# EAGLE design BQ25504 (EAGLE 7.1.0)
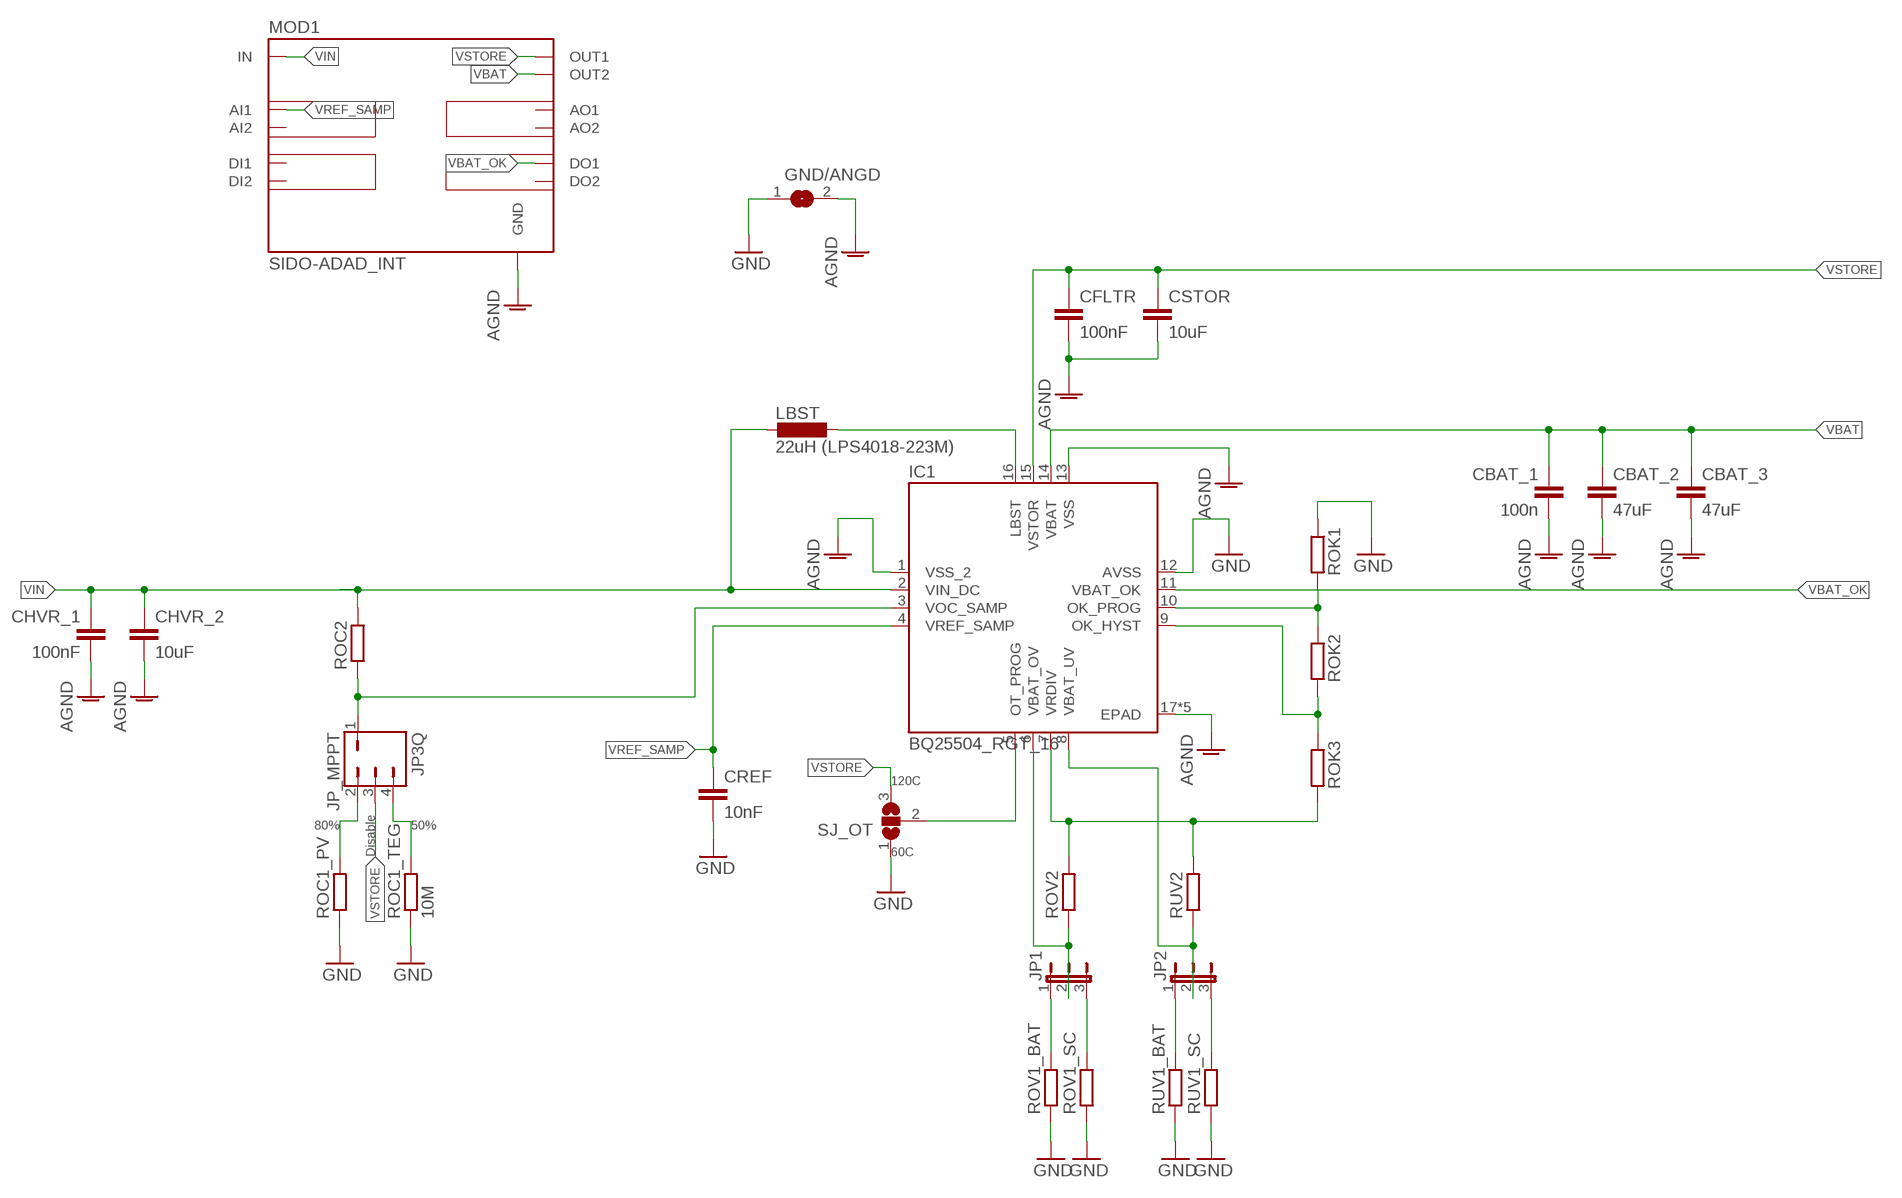
[diagram p0: schematic, sheet 1]

## Parts
CBAT_1  100n  C-EUC0805K  [C0805K]
CBAT_2  47uF  C-EUC0805K  [C0805K]
CBAT_3  47uF  C-EUC0805K  [C0805K]
CFLTR  100nF  C-EUC0805K  [C0805K]
CHVR_1  100nF  C-EUC0805K  [C0805K]
CHVR_2  10uF  C-EUC0805K  [C0805K]
CREF  10nF  C-EUC0805K  [C0805K]
CSTOR  10uF  C-EUC0805K  [C0805K]
GND/ANGD  SJ  [SJ]
IC1  BQ25504_RGT_16  [RGT16_1P7X1P7]
JP1  JP2E  [JP2]
JP2  JP2E  [JP2]
JP_MPPT  JP3Q  [JP1-3]
LBST  22uH (LPS4018-223M)  LPS4018  [LPS4018]
MOD1  SIDO-ADAD_INT  [SIDO-ADAD]
ROC1_PV  R-EU_R0805  [R0805]
ROC1_TEG  10M  R-EU_R0805  [R0805]
ROC2  R-EU_R0805  [R0805]
ROK1  R-EU_R0805  [R0805]
ROK2  R-EU_R0805  [R0805]
ROK3  R-EU_R0805  [R0805]
ROV1_BAT  R-EU_R0805  [R0805]
ROV1_SC  R-EU_R0805  [R0805]
ROV2  R-EU_R0805  [R0805]
RUV1_BAT  R-EU_R0805  [R0805]
RUV1_SC  R-EU_R0805  [R0805]
RUV2  R-EU_R0805  [R0805]
SJ_OT  SJ3  [SJ3]

## Nets
AGND: CBAT_1.2 CBAT_2.2 CBAT_3.2 CFLTR.2 CHVR_1.2 CHVR_2.2 CSTOR.2 GND/ANGD.2 IC1.1(VSS_2) IC1.13(VSS) IC1.17(EPAD) IC1.V(EPAD) IC1.V_2(EPAD) IC1.V_3(EPAD) IC1.V_4(EPAD) MOD1.GND1(GND) MOD1.GND2(GND) MOD1.GND3(GND) MOD1.GND4(GND)
GND: CREF.2 GND/ANGD.1 IC1.12(AVSS) ROC1_PV.1 ROC1_TEG.1 ROK1.1 ROV1_BAT.1 ROV1_SC.1 RUV1_BAT.1 RUV1_SC.1 SJ_OT.1
N$2: IC1.16(LBST) LBST.2
N$4: JP_MPPT.4 ROC1_TEG.2
N$5: IC1.10(OK_PROG) ROK1.2 ROK2.1
N$6: IC1.9(OK_HYST) ROK2.2 ROK3.1
N$7: JP_MPPT.2 ROC1_PV.2
N$8: IC1.5(OT_PROG) SJ_OT.2
N$10: IC1.3(VOC_SAMP) JP_MPPT.1 ROC2.1
N$13: JP1.1 ROV1_BAT.2
N$19: JP1.3 ROV1_SC.2
N$20: IC1.6(VBAT_OV) JP1.2 ROV2.1
N$21: JP2.1 RUV1_BAT.2
N$22: JP2.3 RUV1_SC.2
N$23: IC1.8(VBAT_UV) JP2.2 RUV2.1
VBAT: CBAT_1.1 CBAT_2.1 CBAT_3.1 IC1.14(VBAT) MOD1.OUT2_1(OUT2) MOD1.OUT2_2(OUT2) MOD1.OUT2_3(OUT2) MOD1.OUT2_4(OUT2)
VBAT_OK: IC1.11(VBAT_OK) MOD1.DO1
VIN: CHVR_1.1 CHVR_2.1 IC1.2(VIN_DC) LBST.1 MOD1.IN1(IN) MOD1.IN2(IN) MOD1.IN3(IN) MOD1.IN4(IN)
VIN1: IC1.7(VRDIV) ROK3.2 ROV2.2 RUV2.2
VIN2: ROC2.2
VREF_SAMP: CREF.1 IC1.4(VREF_SAMP) MOD1.AI1
VSTORE: CFLTR.1 CSTOR.1 IC1.15(VSTOR) JP_MPPT.3 MOD1.OUT1_1(OUT1) MOD1.OUT1_2(OUT1) MOD1.OUT1_3(OUT1) MOD1.OUT1_4(OUT1) SJ_OT.3
Unconnected: MOD1.AI2 MOD1.AO1 MOD1.AO2 MOD1.DI1 MOD1.DI2 MOD1.DO2

## Notes on the sheet
- 120C
- 80% | 50%
- Disable | 60C

## Library data of the parts
CBAT_1-CBAT_3 CFLTR CHVR_1 CHVR_2 CREF CSTOR = rcl:C-EU: CAPACITOR, European symbol
GND/ANGD = jumper:SJ: SMD solder JUMPER
IC1 = BQ25504:BQ25504_RGT_16; DATASHEETURL: http://www.ti.com/lit/gpn/BQ25504; DESCRIPTION: Ultra Low Power Boost Converter with Battery Management for Energy Harvester App; FAMILY_NAME: BATTERY CHARGE MANAGEMENT; GENERIC_PART_NUMBER: BQ25504; INDUSTRY_STD_PKG_TYPE: QFN; MANUFACTURER: Texas Instruments; PACKAGE_DESIGNATOR: RGT; PIN_COUNT: 16
JP1 JP2 = Jumper_mod:JP2E: JUMPER
JP_MPPT = Jumper_mod:JP3Q
LBST = LPS4018:LPS4018: COILCRAFT
MOD1 = AllModules:SIDO-ADAD_INT
ROC1_PV ROC1_TEG ROC2 ROK1-ROK3 ROV1_BAT ROV1_SC ROV2 RUV1_BAT RUV1_SC RUV2 = rcl:R-EU_: RESISTOR, European symbol
SJ_OT = Jumper_mod:SJ3: SMD solder JUMPER

## Board
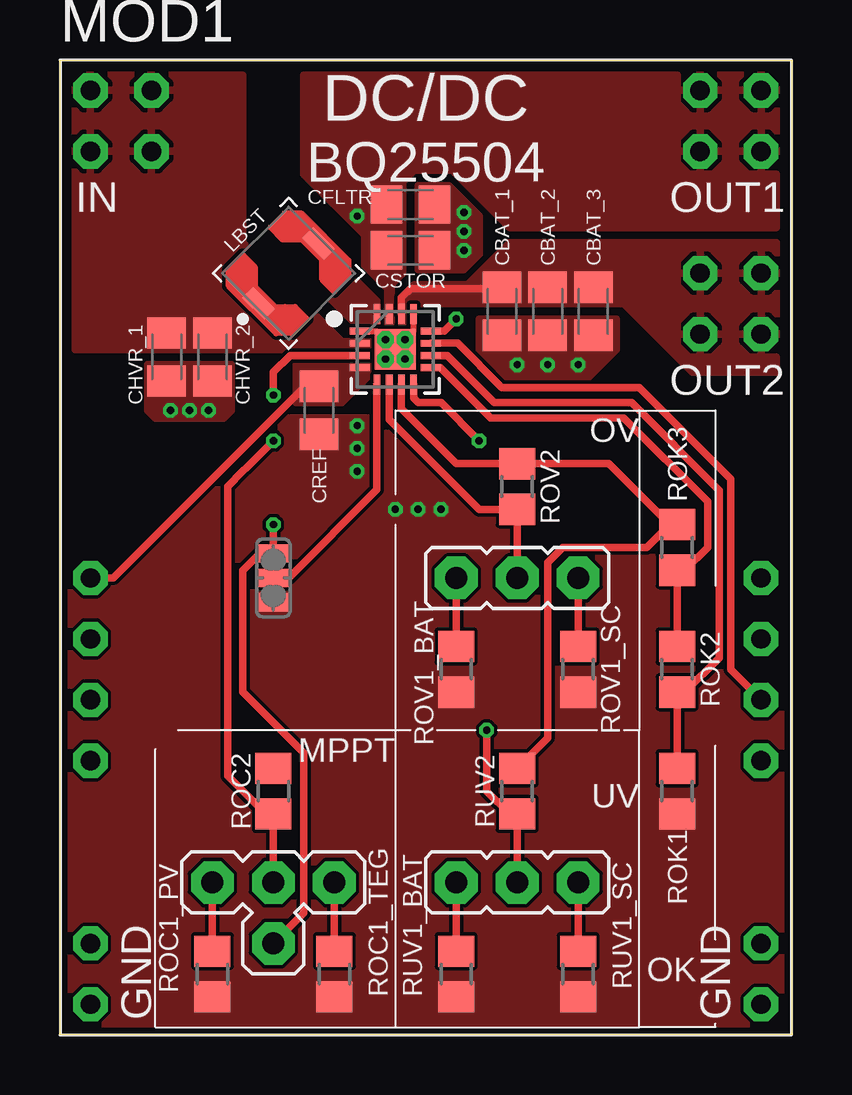
[diagram p1: board, top side]
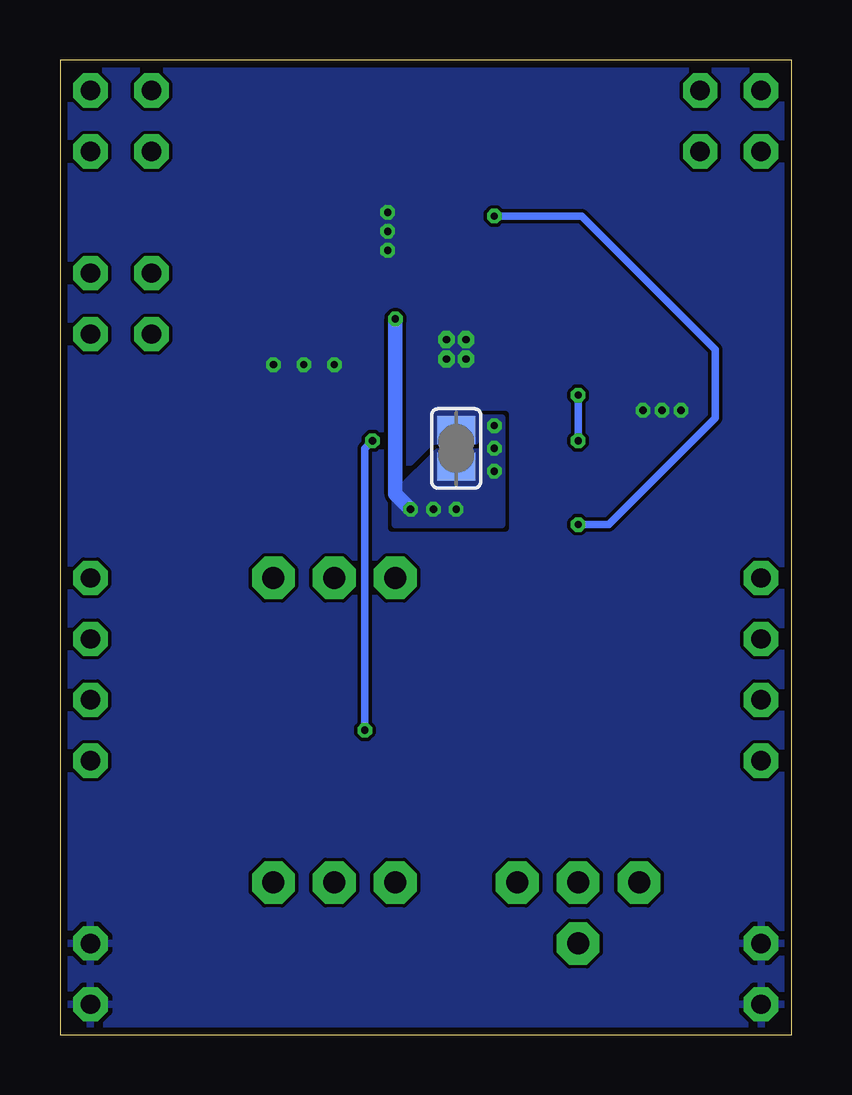
[diagram p2: board, bottom side, seen from below]

Size 30.48 x 40.64 mm. Coordinates in mm from the lower left corner, seen from the top.
Outline: 0,40.64 30.48,40.64 30.48,0 0,0 0,40.64
Copper layers (1*16): Top 0.035mm / dielectric 1.5mm / Bottom 0.035mm
Design rules "PCB-POOL Standard": minimum track width 0.15mm, minimum drill 0.3mm, track to track 0.15mm, track to pad 0.15mm, pad to pad 0.15mm, via to via 0.15mm, smd to smd 0.15mm, copper to edge 0.3mm, drill to drill 0.2mm, minimum pad ring 0.2mm, minimum via ring 0.15mm, stop-mask expansion 0.075mm, vias tented up to drill 0mil, thermal gap 0.2mm

### Footprints (pad centres in the part's own frame; a part is rotated, then mirrored left to right if it is on the bottom)
C0805K = smd 1.3 x 1.6: 1 -1,0; 2 1,0
SJ = smd 1.168 x 1.6: 1 -0.762,0; 2 0.762,0
RGT16_1P7X1P7 = smd 0.838 x 0.279: 1 -1.473,0.762; 2 -1.473,0.254; 3 -1.473,-0.254; 4 -1.473,-0.762; 9 1.473,-0.762; 10 1.473,-0.254; 11 1.473,0.254; 12 1.473,0.762 | smd 0.279 x 0.838: 5 -0.762,-1.473; 6 -0.254,-1.473; 7 0.254,-1.473; 8 0.762,-1.473; 13 0.762,1.473; 14 0.254,1.473; 15 -0.254,1.473; 16 -0.762,1.473 | smd 1.702 x 1.702: 17 0,0 | drill 0.305 octagon: V 0.406,0.406; V_2 -0.406,0.406; V_3 -0.406,-0.406; V_4 0.406,-0.406
JP2 = drill 0.914 pad 1.778 octagon: 1 -2.54,0; 2 0,0; 3 2.54,0
JP1-3 = drill 0.914 pad 1.778 octagon: 1 0,0; 2 0,2.54; 3 -2.54,0; 4 0,-2.54
LPS4018 = smd 0.635 x 1.27: 1 -1.765,0; 2 1.765,0
SIDO-ADAD = drill 0.8 pad 1.422 octagon: AI1 0,-20.32; AI2 0,-22.86; AO1 27.94,-20.32; AO2 27.94,-22.86; DI1 0,-25.4; DI2 0,-27.94; DO1 27.94,-25.4; DO2 27.94,-27.94; GND1 0,-38.1; GND2 0,-35.56; GND3 27.94,-35.56; GND4 27.94,-38.1; IN1 0,0; IN2 0,-2.54; IN3 2.54,0; IN4 2.54,-2.54; OUT1_1 25.4,0; OUT1_2 25.4,-2.54; OUT1_3 27.94,0; OUT1_4 27.94,-2.54; OUT2_1 25.4,-7.62; OUT2_2 25.4,-10.16; OUT2_3 27.94,-7.62; OUT2_4 27.94,-10.16
R0805 = smd 1.3 x 1.5: 1 -0.95,0; 2 0.95,0
SJ3 = smd 0.762 x 1.27: 1 -1.016,0; 2 0,0; 3 1.016,0

### Placement (x,y rotation side)
CBAT_1  18.41,30.16 270 top
CBAT_2  20.32,30.16 270 top
CBAT_3  22.22,30.16 270 top
CFLTR  14.61,34.61 0 top
CHVR_1  4.45,28.26 270 top
CHVR_2  6.35,28.26 270 top
CREF  10.79,26.03 270 top
CSTOR  14.61,32.7 0 top
GND/ANGD  13.97,24.45 90 bottom
IC1  13.97,28.57 0 top
JP1  19.05,19.05 0 top
JP2  19.05,6.35 0 top
JP_MPPT  8.89,6.35 90 top
LBST  9.53,31.75 45 top
MOD1  1.27,39.37 0 top
ROC1_PV  6.35,2.54 90 top
ROC1_TEG  11.43,2.54 90 top
ROC2  8.89,10.16 90 top
ROK1  25.72,10.16 90 top
ROK2  25.72,15.24 90 top
ROK3  25.72,20.32 90 top
ROV1_BAT  16.51,15.24 90 top
ROV1_SC  21.59,15.24 90 top
ROV2  19.05,22.86 90 top
RUV1_BAT  16.51,2.54 90 top
RUV1_SC  21.59,2.54 90 top
RUV2  19.05,10.16 90 top
SJ_OT  8.89,19.05 90 top

### Tracks (layer width: path | path; a pad name or v marks a point on that pad's centre or on a via)
AGND  (via drill 0.3)
  Top 0.254: IC1.1 13.21,29.34 IC1.V_2 | IC1.V 14.73,29.34 IC1.13
  Top 0.305: IC1.V_2 13.97,28.98 IC1.17
  other vias: 16.83,34.29 16.83,33.5 16.83,32.7 6.19,26.03 5.4,26.03 4.6,26.03 19.05,27.94 20.32,27.94 21.59,27.94
  pour Bottom (rank 3): -0.64,41.27 -0.64,-0.64 31.11,-0.64 31.11,41.27
  pour Top (no thermals): 14.92,35.4 16.19,35.4 17.46,34.13 17.46,32.54 16.83,31.91 14.92,31.91
  pour Top (no thermals): 7.14,27.94 7.14,26.03 6.83,25.72 3.97,25.72 3.65,26.03 3.65,27.94
  pour Bottom (no thermals): 15.24,26.03 13.18,26.03 13.18,24.76 15.24,24.76
  pour Top (no thermals): 17.46,29.84 17.46,28.57 17.78,28.26 18.73,27.3 19.37,27.3 21.91,27.3 23.18,28.57 23.18,29.84
GND  (via drill 0.3)
  Top 0.305: IC1.12 16,29.34 v16.51,29.84
  Bottom 0.61: v15.88,21.91 16.51,22.54 v16.51,29.84
  other vias: 12.38,25.4 12.38,24.45 12.38,23.49 13.97,21.91 14.92,21.91
  pour Top (rank 2, no thermals): -1.27,-1.27 31.75,-1.27 31.75,24.76 25.08,24.76 24.13,25.72 8.89,25.72 7.94,24.76 -1.27,24.76
  pour Top (no thermals): 9.68,24.13 11.91,24.13 11.91,25.72 9.68,25.72
  pour Bottom (rank 2, no thermals): 12.06,25.72 13.02,25.72 13.02,24.45 14.61,24.45 16.51,22.54 16.51,21.27 12.06,21.27
N$2
  pour Top (rank 2, no thermals): 9.84,35.24 8.26,33.66 12.38,29.53 13.33,29.53 13.33,30.48 12.06,31.75 12.06,33.02
N$3
  Bottom 0.406: 13.97,25.4 13.97,23.49
N$4
  Top 0.305: JP_MPPT.4 ROC1_TEG.2
N$5
  Top 0.305: ROK1.2 ROK2.1 26.04,14.29 27.46,15.72 27.46,22.7 23.81,26.35 18.1,26.35 16.13,28.32 IC1.10
N$6
  Top 0.305: ROK2.2 ROK3.1 26.04,19.37 26.99,20.32 26.99,22.22 23.5,25.72 17.94,25.72 15.84,27.81 IC1.9
N$7
  Top 0.305: ROC1_PV.2 JP_MPPT.2
N$8
  Top 0.305: IC1.5 13.21,22.73 9.53,19.05 SJ_OT.2
N$10  (via drill 0.3)
  Top 0.305: JP_MPPT.1 ROC2.1 8.57,9.21 6.98,10.79 6.98,22.86 7.62,23.49 7.78,23.65 v8.89,24.76 | IC1.3 9.59,28.32 8.89,27.62 v8.89,26.67
  Bottom 0.305: v8.89,24.76 v8.89,26.67
N$13
  Top 0.305: JP1.1 ROV1_BAT.2
N$19
  Top 0.305: JP1.3 ROV1_SC.2
N$20
  Top 0.305: JP1.2 ROV2.1 17.46,21.91 13.72,25.65 IC1.6
N$21
  Top 0.305: JP2.1 RUV1_BAT.2
N$22
  Top 0.305: JP2.3 RUV1_SC.2
N$23  (via drill 0.3)
  Top 0.305: JP2.2 RUV2.1 18.73,9.21 17.78,10.16 v17.78,12.7 | IC1.8 14.73,26.54 14.92,26.35 15.88,26.35 v17.46,24.76
  Bottom 0.305: v17.46,24.76 17.78,24.45 v17.78,12.7
VBAT
  Top 0.305: IC1.14 14.22,30.73 14.61,31.11 18.37,31.11 CBAT_1.1
  pour Top (rank 2, no thermals): 13.97,29.53 13.97,30.48 14.76,31.27 16.99,31.27 18.73,33.02 25.72,33.02 25.72,28.73 26.19,28.26 29.84,28.26 29.84,27.62 26.35,27.62 23.5,30.48 14.29,30.48 14.29,29.53
  pour Top: 29.84,33.02 25.72,33.02 25.72,28.26 29.84,28.26
VBAT_OK
  Top 0.305: IC1.11 16.57,28.83 18.41,26.99 24.13,26.99 27.94,23.18 27.94,15.24 MOD1.DO1
VIN
  pour Top (no thermals): 0.64,28.57 13.02,28.57 13.02,28.89 11.75,28.89 7.62,33.02 7.62,40 5.08,40 5.08,35.56 0.64,35.56
  pour Top: 0.64,40 0.64,35.56 5.08,35.56 5.08,40
VIN1
  Top 0.305: IC1.7 14.22,26.1 16.51,23.81 ROV2.2 22.86,23.81 25.4,21.27 | 25.4,21.27 ROK3.2 | 25.4,21.27 24.45,20.32 20.95,20.32 20.32,19.68 20.32,12.38 RUV2.2
VREF_SAMP
  Top 0.305: 10.53,27.35 2.22,19.05 MOD1.AI1
  pour Top (no thermals): 9.84,27.94 9.84,26.35 11.75,26.35 13.02,27.62 13.02,27.94
VSTORE  (via drill 0.3)
  Top 0.305: v8.89,21.27 SJ_OT.3 8.32,20.07 7.62,19.37 7.62,14.29 10.16,11.75 10.16,5.08 JP_MPPT.3 | CFLTR.1 13.65,34.66
  Bottom 0.305: v8.89,21.27 7.62,21.27 3.17,25.72 3.17,28.57 8.73,34.13 v12.38,34.13
  pour Top (no thermals): 10.16,40 10.16,35.88 12.7,33.34 12.7,32.07 13.65,31.11 13.65,29.53 13.81,29.53 13.81,31.27 14.29,31.75 14.29,35.56 14.76,36.04 16.35,36.04 18.73,33.66 29.84,33.66 29.84,35.88 26.19,35.88 25.72,36.35 25.72,40
  pour Top: 29.84,40 25.72,40 25.72,36.51 26.35,35.88 29.84,35.88

### Text on the board
tNames: DC/DC | BQ25504 | OV | MPPT | UV | OK
bStop: by Kokert & Beckedahl / 25.04.2017